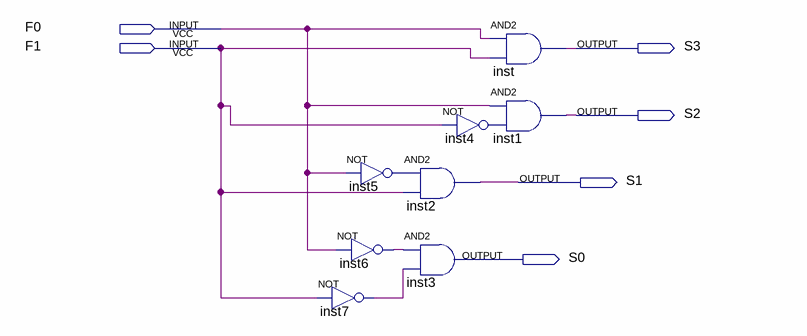
[diagram p0: schematic sheet]
// Quartus schematic DECODER_2TO4.bdf as structural Verilog: 8 symbols, 6 pins
module DECODER_2TO4 (
  input  F0,
  input  F1,
  output S3,
  output S2,
  output S1,
  output S0
);

  wire inst4_out, inst5_out, inst6_out, inst7_out;

  not inst6 (inst6_out, F0);
  not inst7 (inst7_out, F1);
  and inst2 (S1, inst5_out, F1);
  not inst5 (inst5_out, F0);
  and inst3 (S0, inst6_out, inst7_out);
  and inst (S3, F0, F1);
  and inst1 (S2, F0, inst4_out);
  not inst4 (inst4_out, F1);
endmodule
